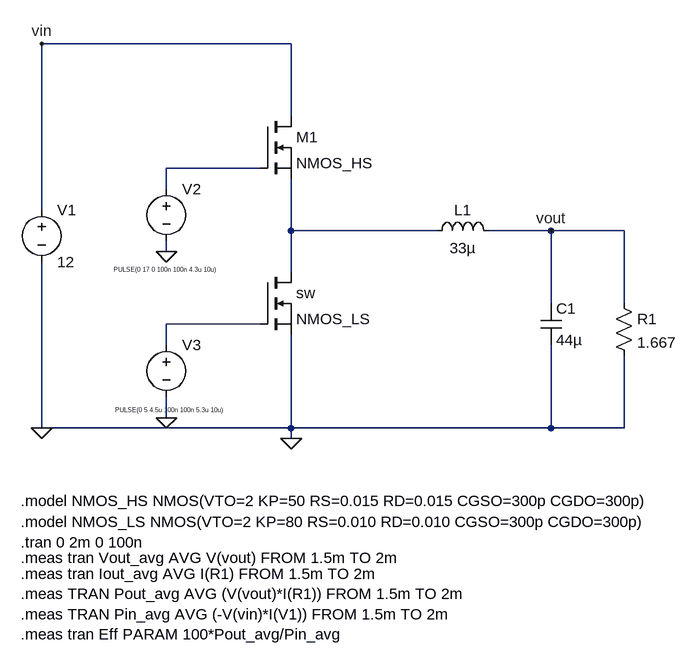
[diagram p0: schematic buckConverterRealness.asc]
buckConverterRealness.asc, the LTspice schematic file:
Version 4.1
SHEET 1 888 680
WIRE -80 -576 -464 -576
WIRE -80 -464 -80 -576
WIRE -128 -384 -272 -384
WIRE -272 -352 -272 -384
WIRE -464 -320 -464 -576
WIRE -80 -288 -80 -368
WIRE 144 -288 -80 -288
WIRE 320 -288 224 -288
WIRE 432 -288 320 -288
WIRE -272 -256 -272 -272
WIRE -80 -224 -80 -288
WIRE 320 -176 320 -288
WIRE 432 -176 432 -288
WIRE -128 -144 -272 -144
WIRE -272 -112 -272 -144
WIRE -272 0 -272 -32
WIRE -464 16 -464 -240
WIRE -80 16 -80 -128
WIRE -80 16 -464 16
WIRE 320 16 320 -112
WIRE 320 16 -80 16
WIRE 432 16 432 -96
WIRE 432 16 320 16
WIRE -80 32 -80 16
FLAG -80 32 0
FLAG -464 16 0
FLAG -272 0 0
FLAG -272 -256 0
FLAG 320 -288 vout
FLAG -464 -576 vin
SYMBOL nmos -128 -464 R0
SYMATTR InstName M1
SYMATTR Value NMOS_HS
SYMBOL ind 128 -272 R270
WINDOW 0 32 56 VTop 2
WINDOW 3 5 56 VBottom 2
SYMATTR InstName L1
SYMATTR Value 33µ
SYMATTR SpiceLine Rser=0.05
SYMBOL cap 304 -176 R0
SYMATTR InstName C1
SYMATTR Value 44µ
SYMATTR SpiceLine Rser=0.03
SYMBOL res 416 -192 R0
SYMATTR InstName R1
SYMATTR Value 1.667
SYMBOL nmos -128 -224 R0
SYMATTR InstName sw
SYMATTR Value NMOS_LS
SYMBOL voltage -272 -368 R0
WINDOW 3 -81 140 Left 0
WINDOW 123 0 0 Left 0
WINDOW 39 0 0 Left 0
SYMATTR InstName V2
SYMATTR Value PULSE(0 17 0 100n 100n 4.3u 10u)
SYMBOL voltage -272 -128 R0
WINDOW 3 -79 116 Left 0
WINDOW 123 0 0 Left 0
WINDOW 39 0 0 Left 0
SYMATTR InstName V3
SYMATTR Value PULSE(0 5 4.5u 100n 100n 5.3u 10u)
SYMBOL voltage -464 -336 R0
WINDOW 123 0 0 Left 0
WINDOW 39 0 0 Left 0
SYMATTR InstName V1
SYMATTR Value 12
TEXT -496 128 Left 2 !.model NMOS_HS NMOS(VTO=2 KP=50 RS=0.015 RD=0.015 CGSO=300p CGDO=300p)
TEXT -496 160 Left 2 !.model NMOS_LS NMOS(VTO=2 KP=80 RS=0.010 RD=0.010 CGSO=300p CGDO=300p)
TEXT -496 192 Left 2 !.tran 0 2m 0 100n
TEXT -496 216 Left 2 !.meas tran Vout_avg AVG V(vout) FROM 1.5m TO 2m
TEXT -496 240 Left 2 !.meas tran Iout_avg AVG I(R1) FROM 1.5m TO 2m\n.meas TRAN Pout_avg AVG (V(vout)*I(R1)) FROM 1.5m TO 2m\n.meas TRAN Pin_avg AVG (-V(vin)*I(V1)) FROM 1.5m TO 2m\n.meas tran Eff PARAM 100*Pout_avg/Pin_avg

The netlist it stands for:
* buckConverterRealness.asc
M1 vin N001 N002 N002 NMOS_HS
L1 N002 vout 33µ Rser=0.05
C1 vout 0 44µ Rser=0.03
R1 vout 0 1.667
M§sw N002 N003 0 0 NMOS_LS
V2 N001 0 PULSE(0 17 0 100n 100n 4.3u 10u)
V3 N003 0 PULSE(0 5 4.5u 100n 100n 5.3u 10u)
V1 vin 0 12
.model NMOS NMOS
.model PMOS PMOS
.lib standard.mos
.model NMOS_HS NMOS(VTO=2 KP=50 RS=0.015 RD=0.015 CGSO=300p CGDO=300p)
.model NMOS_LS NMOS(VTO=2 KP=80 RS=0.010 RD=0.010 CGSO=300p CGDO=300p)
.tran 0 2m 0 100n
.meas tran Vout_avg AVG V(vout) FROM 1.5m TO 2m
.meas tran Iout_avg AVG I(R1) FROM 1.5m TO 2m
.meas TRAN Pout_avg AVG (V(vout)*I(R1)) FROM 1.5m TO 2m
.meas TRAN Pin_avg AVG (-V(vin)*I(V1)) FROM 1.5m TO 2m
.meas tran Eff PARAM 100*Pout_avg/Pin_avg
.backanno
.end